# Altium schematic sheet Sheet1.SchDoc
size C
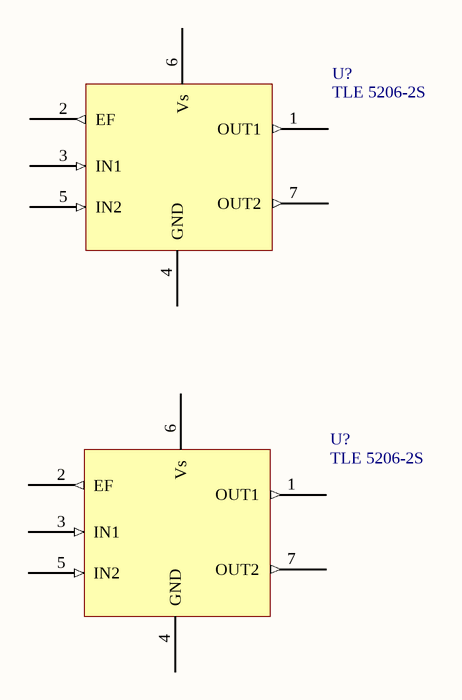
[diagram p0: Sheet1.SchDoc]

## Parts
(Parts that share a designator on the sheet are numbered #1, #2 ... from top to bottom, then left to right.)
U?#1  TLE 5206-2S  [Model Name]
U?#2  TLE 5206-2S  [Model Name]

## Nets

Not connected (* = marked no-connect by the designer): U?#1 1(OUT1) 2(EF) 3(IN1) 4(GND) 5(IN2) 6(Vs) 7(OUT2); U?#2 1(OUT1) 2(EF) 3(IN1) 4(GND) 5(IN2) 6(Vs) 7(OUT2)

## Library data of the parts
U?#1 U?#2 = TLE 5206-2S: Infineon TLE 5206-2S Hbridge